# EasyEDA Pro project PCB.eprj, schematic Instruction_Register
Board Name: Instruction_Register; Create Date: 2025-08-05; Page Name: P1; Project Name: PCB; Schematic Name: Instruction_Register; Update Date: 2025-08-11; Company: EasyEDA.com; Page Size: A4; Version: V1.0
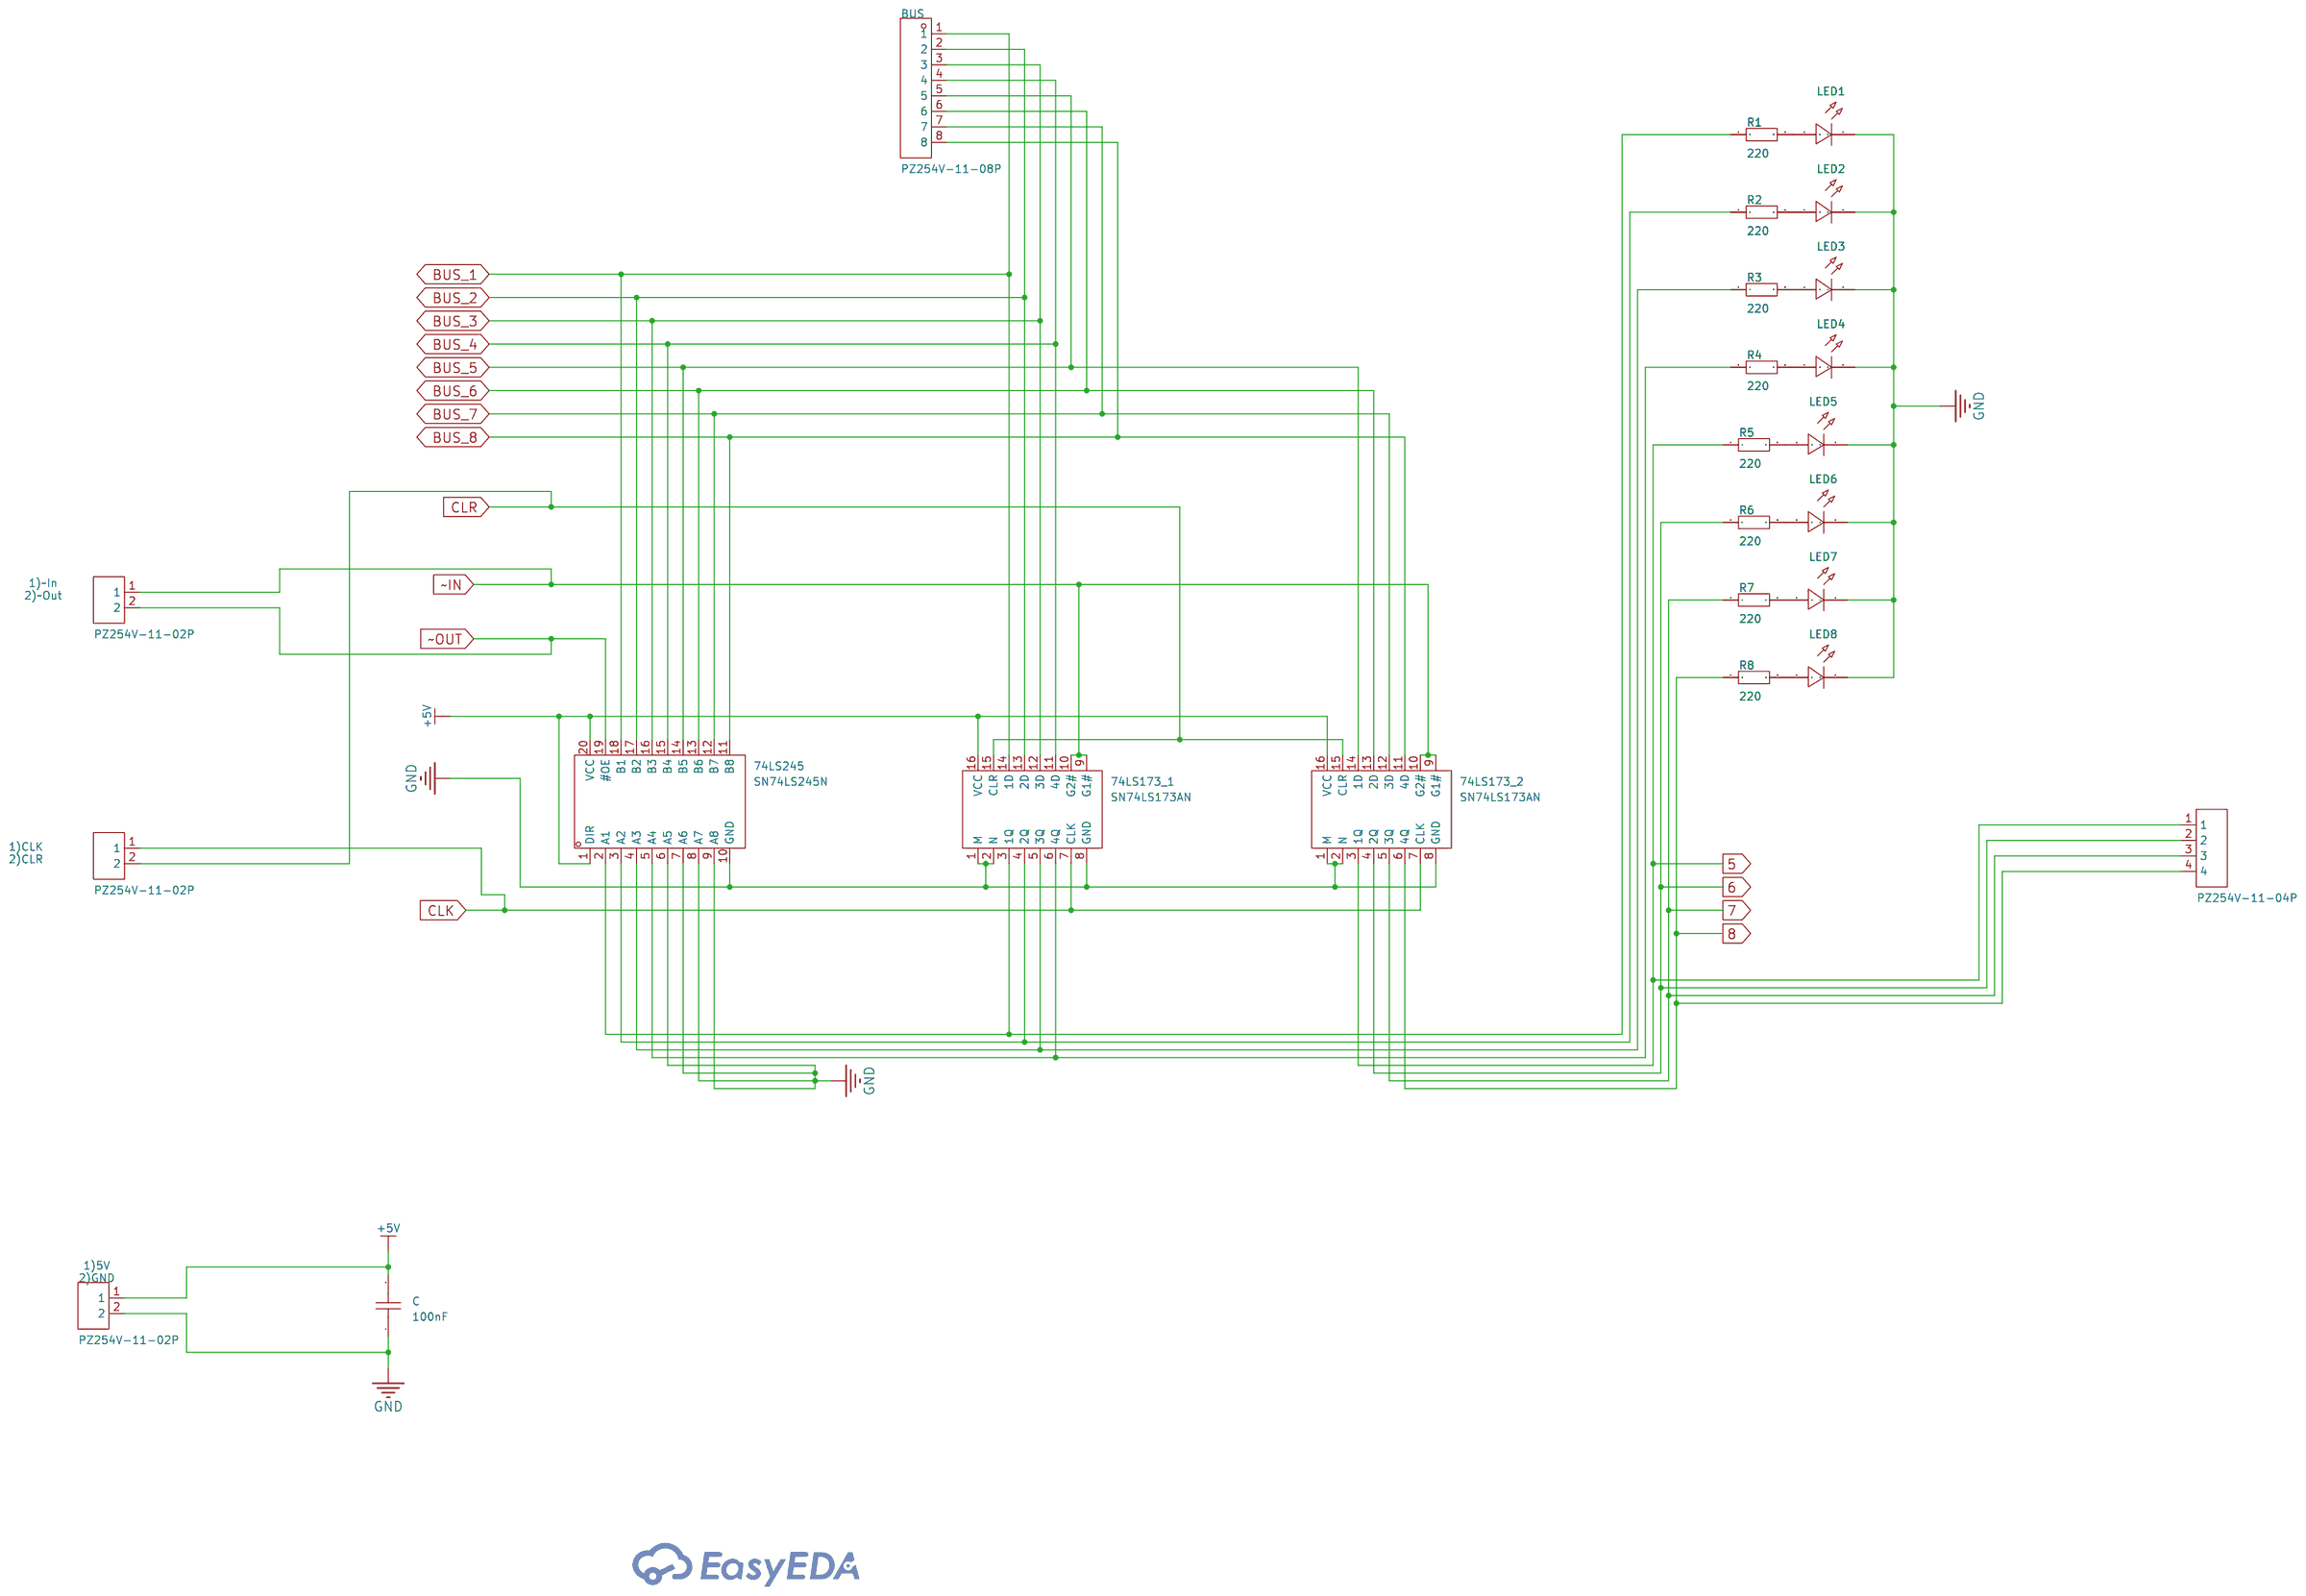
[diagram p1: schematic sheet]

## Parts
1)5V
2)GND  PZ254V-11-02P  [HDR-TH_2P-P2.54-V-M]
1)CLK
2)CLR  PZ254V-11-02P  [HDR-TH_2P-P2.54-V-M]
1)~In
2)~Out  PZ254V-11-02P  [HDR-TH_2P-P2.54-V-M]
74LS173_1  SN74LS173AN  [PDIP-16_L19.3-W6.4-P2.54-LS7.94-BL]
74LS173_2  SN74LS173AN  [PDIP-16_L19.3-W6.4-P2.54-LS7.94-BL]
74LS245  SN74LS245N  [DIP-20_L25.5-W10.0-P2.54-LS7.6-BL]
BUS  PZ254V-11-08P  [HDR-TH_8P-P2.54-V-M]
C  100nF  [CAP-TH_L8.5-W5.0-P5.00-D1.2]
H?#7  PZ254V-11-04P  [HDR-TH_4P-P2.54-V-M]
LED1  -  [LED-TH_BD5.8-P2.54-FD]
LED2  -  [LED-TH_BD5.8-P2.54-FD]
LED3  -  [LED-TH_BD5.8-P2.54-FD]
LED4  -  [LED-TH_BD5.8-P2.54-FD]
LED5  -  [LED-TH_BD5.8-P2.54-FD]
LED6  -  [LED-TH_BD5.8-P2.54-FD]
LED7  -  [LED-TH_BD5.8-P2.54-FD]
LED8  -  [LED-TH_BD5.8-P2.54-FD]
R1  220  [R_AXIAL-0.4]
R2  220  [R_AXIAL-0.4]
R3  220  [R_AXIAL-0.4]
R4  220  [R_AXIAL-0.4]
R5  220  [R_AXIAL-0.4]
R6  220  [R_AXIAL-0.4]
R7  220  [R_AXIAL-0.4]
R8  220  [R_AXIAL-0.4]

## Library data of the parts
1)5V
2)GND 1)CLK
2)CLR 1)~In
2)~Out = PZ254V-11-02P: LCSC Part Name: 1x2P 间距:2.54mm 方针 直插; Supplier Part: C492401; Manufacturer: XFCN(兴飞); Supplier Footprint: 插件,P=2.54mm; JLCPCB Part Class: Extended Part; Datasheet: https://atta.szlcsc.com/upload/public/pdf/source/20200309/C492401_A812433581A9B211A7FFA413ADDFF0E5.pdf; Supplier: LCSC; Pin Structure: 1x2P; Pitch: 2.54mm; Circluar Pins/Square Pins: Policy; Mounting Type: Straight; Number of Rows: Single Row; Number of Pins: 2P; Length of Mating Pin: 6mm; Insulation Height: 2.5mm; Length of End Connection Pin: 3mm; Contact Material: Brass; Operating Temperature: -40℃~+105℃; Color: Black
74LS173_1 74LS173_2 = SN74LS173AN: Type:D-Type Trigger Type:Rising Edge Voltage - Supply:4.75V~5.25V Voltage - Supply:4.75V~5.25V Clock Frequency:50MHz Function:Reset Number of Elements:1 Number of Bits per Element:4 Output Type:- Propagation Delay:30ns@5V,45pF Series:74LS Series Current -; Supplier Part: C1550125; Manufacturer: TI(德州仪器); Supplier Footprint: PDIP-16; JLCPCB Part Class: Extended Part; Datasheet: https://www.ti.com/cn/lit/gpn/sn74ls173a; Supplier: LCSC; Type: D-Type; Trigger Type: Rising Edge; Voltage - Supply: 4.75V~5.25V; Clock Frequency: 50MHz; Function: Reset; Number of Elements: 1; Number of Bits per Element: 4; Propagation Delay: 30ns@5V,45pF; Series: 74LS Series; Current - Output Low(IOL): 24mA; Current - Output High(IOH): 2.6mA; Quiescent Current: 24mA; Operating Temperature: 0℃~+70℃
74LS245 = SN74LS245N: output type:Tri-State Voltage - Supply:4.75V~5.25V Voltage - Supply:4.75V~5.25V Number of Elements:1 Number of Bits per Element:8 Current - Output Low(IOL):24mA Current - Output High(IOH):15mA Logic Family:74LS Operating Temperature:0℃~+70℃ Operating Temp; Supplier Part: C352966; Manufacturer: TI(德州仪器); Supplier Footprint: DIP-20; JLCPCB Part Class: Extended Part; Datasheet: https://www.ti.com/cn/lit/gpn/sn74ls245; Supplier: LCSC; output type: Tri-State; Voltage - Supply: 4.75V~5.25V; Number of Elements: 1; Number of Bits per Element: 8; Current - Output Low(IOL): 24mA; Current - Output High(IOH): 15mA; Logic Family: 74LS; Operating Temperature: 0℃~+70℃
BUS = PZ254V-11-08P: LCSC Part Name: 间距:2.54mm 1x8P 直插 方针; Supplier Part: C492407; Manufacturer: XFCN(兴飞); Supplier Footprint: 插件,P=2.54mm; JLCPCB Part Class: Extended Part; Datasheet: https://atta.szlcsc.com/upload/public/pdf/source/20200309/C492407_83A6FB26A2233368EDB9516968EC6149.pdf; Supplier: LCSC; Pin Structure: 1x8P; Pitch: 2.54mm; Circluar Pins/Square Pins: Square Pins; Mounting Type: Straight; Number of Rows: Plugin; Number of Pins: 8P; Length of Mating Pin: 6mm; Insulation Height: 2.5mm; Length of End Connection Pin: 3mm; Operating Temperature Range: -40℃~+105℃; Color: Black
C = CT4-0805B104K500F3: LCSC Part Name: 100nF ±10% 50V C3型（直脚）; Supplier Part: C84772; Manufacturer: FH(风华); Supplier Footprint: 插件,P=5.08mm; JLCPCB Part Class: Extended Part; Datasheet: https://atta.szlcsc.com/upload/public/pdf/source/20190402/C385200_059806A6312B28FF1421A2413EB641E1.pdf; Supplier: LCSC; Tolerance: ±10%
H?#7 = PZ254V-11-04P_C492403: LCSC Part Name: 1x4P 间距:2.54mm 方针 直插; Supplier Part: C492403; Manufacturer: XFCN(兴飞); Supplier Footprint: 插件,P=2.54mm; JLCPCB Part Class: Extended Part; Datasheet: https://atta.szlcsc.com/upload/public/pdf/source/20200309/C492403_F9F19131791D08044AD4F84F8E751A34.pdf; Supplier: LCSC; Pin Structure: 1x4P; Pitch: 2.54mm; Circluar Pins/Square Pins: Policy; Mounting Type: Straight; Number of Rows: Single Row; Number of Pins: 4P; Length of Mating Pin: 6mm; Insulation Height: 2.5mm; Length of End Connection Pin: 3mm; Contact Material: Brass; Operating Temperature: -40℃~+105℃; Color: Black
LED1-LED8 = LED_TH-R_5mm: Supplier Footprint: Through
R1-R8 = Res_AXIAL-1/4W: Supplier Footprint: Through

## Nets
+5V: 1)5V
2)GND.1 74LS173_1.16(VCC) 74LS173_2.16(VCC) 74LS245.1(DIR) 74LS245.20(VCC) C.2
GND: 1)5V
2)GND.2 74LS173_1.1(M) 74LS173_1.2(N) 74LS173_1.8(GND) 74LS173_2.1(M) 74LS173_2.2(N) 74LS173_2.8(GND) 74LS245.6(A5) 74LS245.7(A6) 74LS245.8(A7) 74LS245.9(A8) 74LS245.10(GND) C.1 LED1.2(A) LED2.2(A) LED3.2(A) LED4.2(A) LED5.2(A) LED6.2(A) LED7.2(A) LED8.2(A)
5: 74LS173_2.3(1Q) H?#7.1 R5.1
6: 74LS173_2.4(2Q) H?#7.2 R6.1
7: 74LS173_2.5(3Q) H?#7.3 R7.1
8: 74LS173_2.6(4Q) H?#7.4 R8.1
BUS_1: 74LS173_1.14(1D) 74LS245.18(B1) BUS.1
BUS_2: 74LS173_1.13(2D) 74LS245.17(B2) BUS.2
BUS_3: 74LS173_1.12(3D) 74LS245.16(B3) BUS.3
BUS_4: 74LS173_1.11(4D) 74LS245.15(B4) BUS.4
BUS_5: 74LS173_2.14(1D) 74LS245.14(B5) BUS.5
BUS_6: 74LS173_2.13(2D) 74LS245.13(B6) BUS.6
BUS_7: 74LS173_2.12(3D) 74LS245.12(B7) BUS.7
BUS_8: 74LS173_2.11(4D) 74LS245.11(B8) BUS.8
CLK: 1)CLK
2)CLR.1 74LS173_1.7(CLK) 74LS173_2.7(CLK)
CLR: 1)CLK
2)CLR.2 74LS173_1.15(CLR) 74LS173_2.15(CLR)
~IN: 1)~In
2)~Out.1 74LS173_1.9(G1#) 74LS173_1.10(G2#) 74LS173_2.9(G1#) 74LS173_2.10(G2#)
~OUT: 1)~In
2)~Out.2 74LS245.19(#OE)
$1N9244: LED1.1(C) R1.2
$1N9297: 74LS173_1.6(4Q) 74LS245.5(A4) R4.1
$1N9304: 74LS173_1.5(3Q) 74LS245.4(A3) R3.1
$1N9311: 74LS173_1.4(2Q) 74LS245.3(A2) R2.1
$1N9318: 74LS173_1.3(1Q) 74LS245.2(A1) R1.1
$1N9325: LED8.1(C) R8.2
$1N9326: LED7.1(C) R7.2
$1N9327: LED6.1(C) R6.2
$1N9328: LED5.1(C) R5.2
$1N9329: LED4.1(C) R4.2
$1N9330: LED3.1(C) R3.2
$1N9331: LED2.1(C) R2.2
